# Altium schematic sheet FC_main.SchDoc
size 558 x 431 mm; SheetNumber: 1; SheetTotal: 1
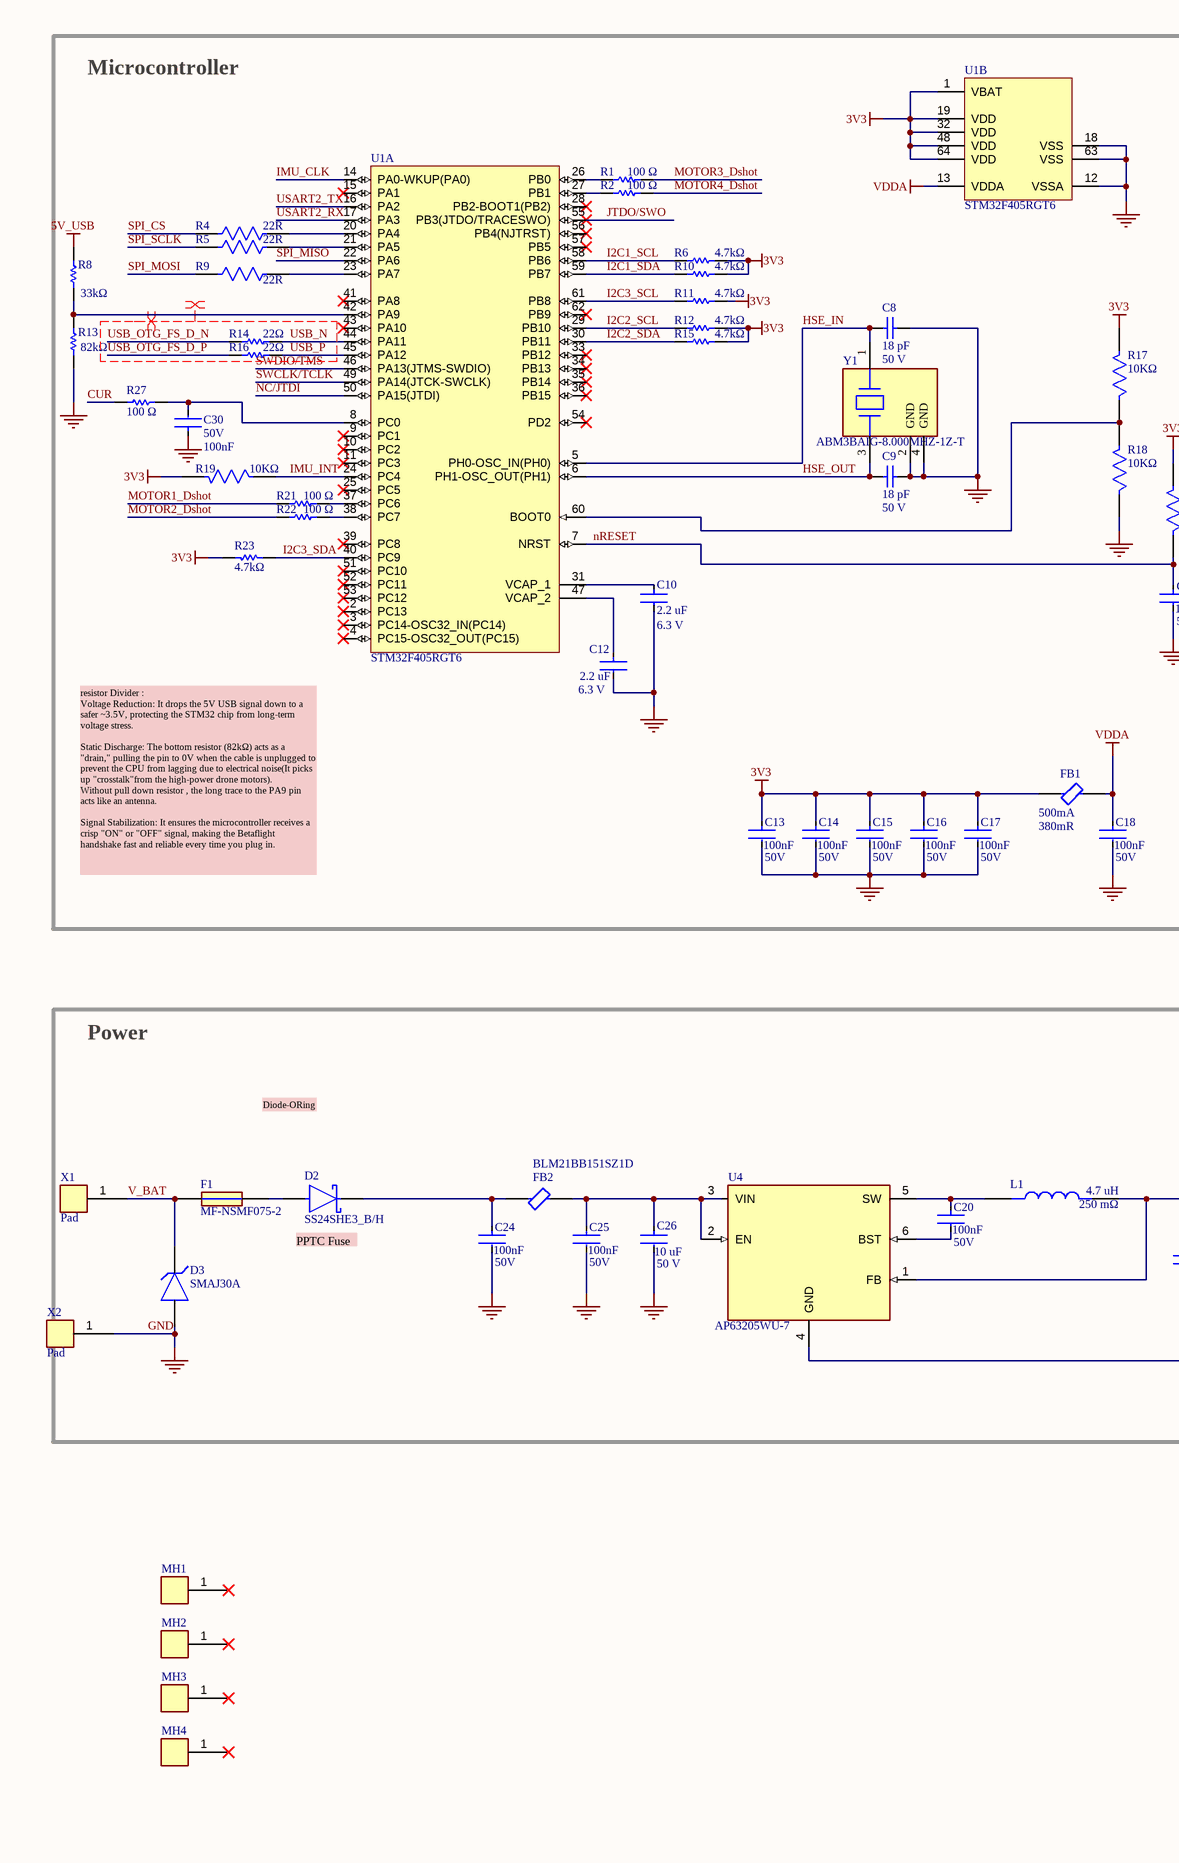
[diagram p0: FC_main.SchDoc, left]
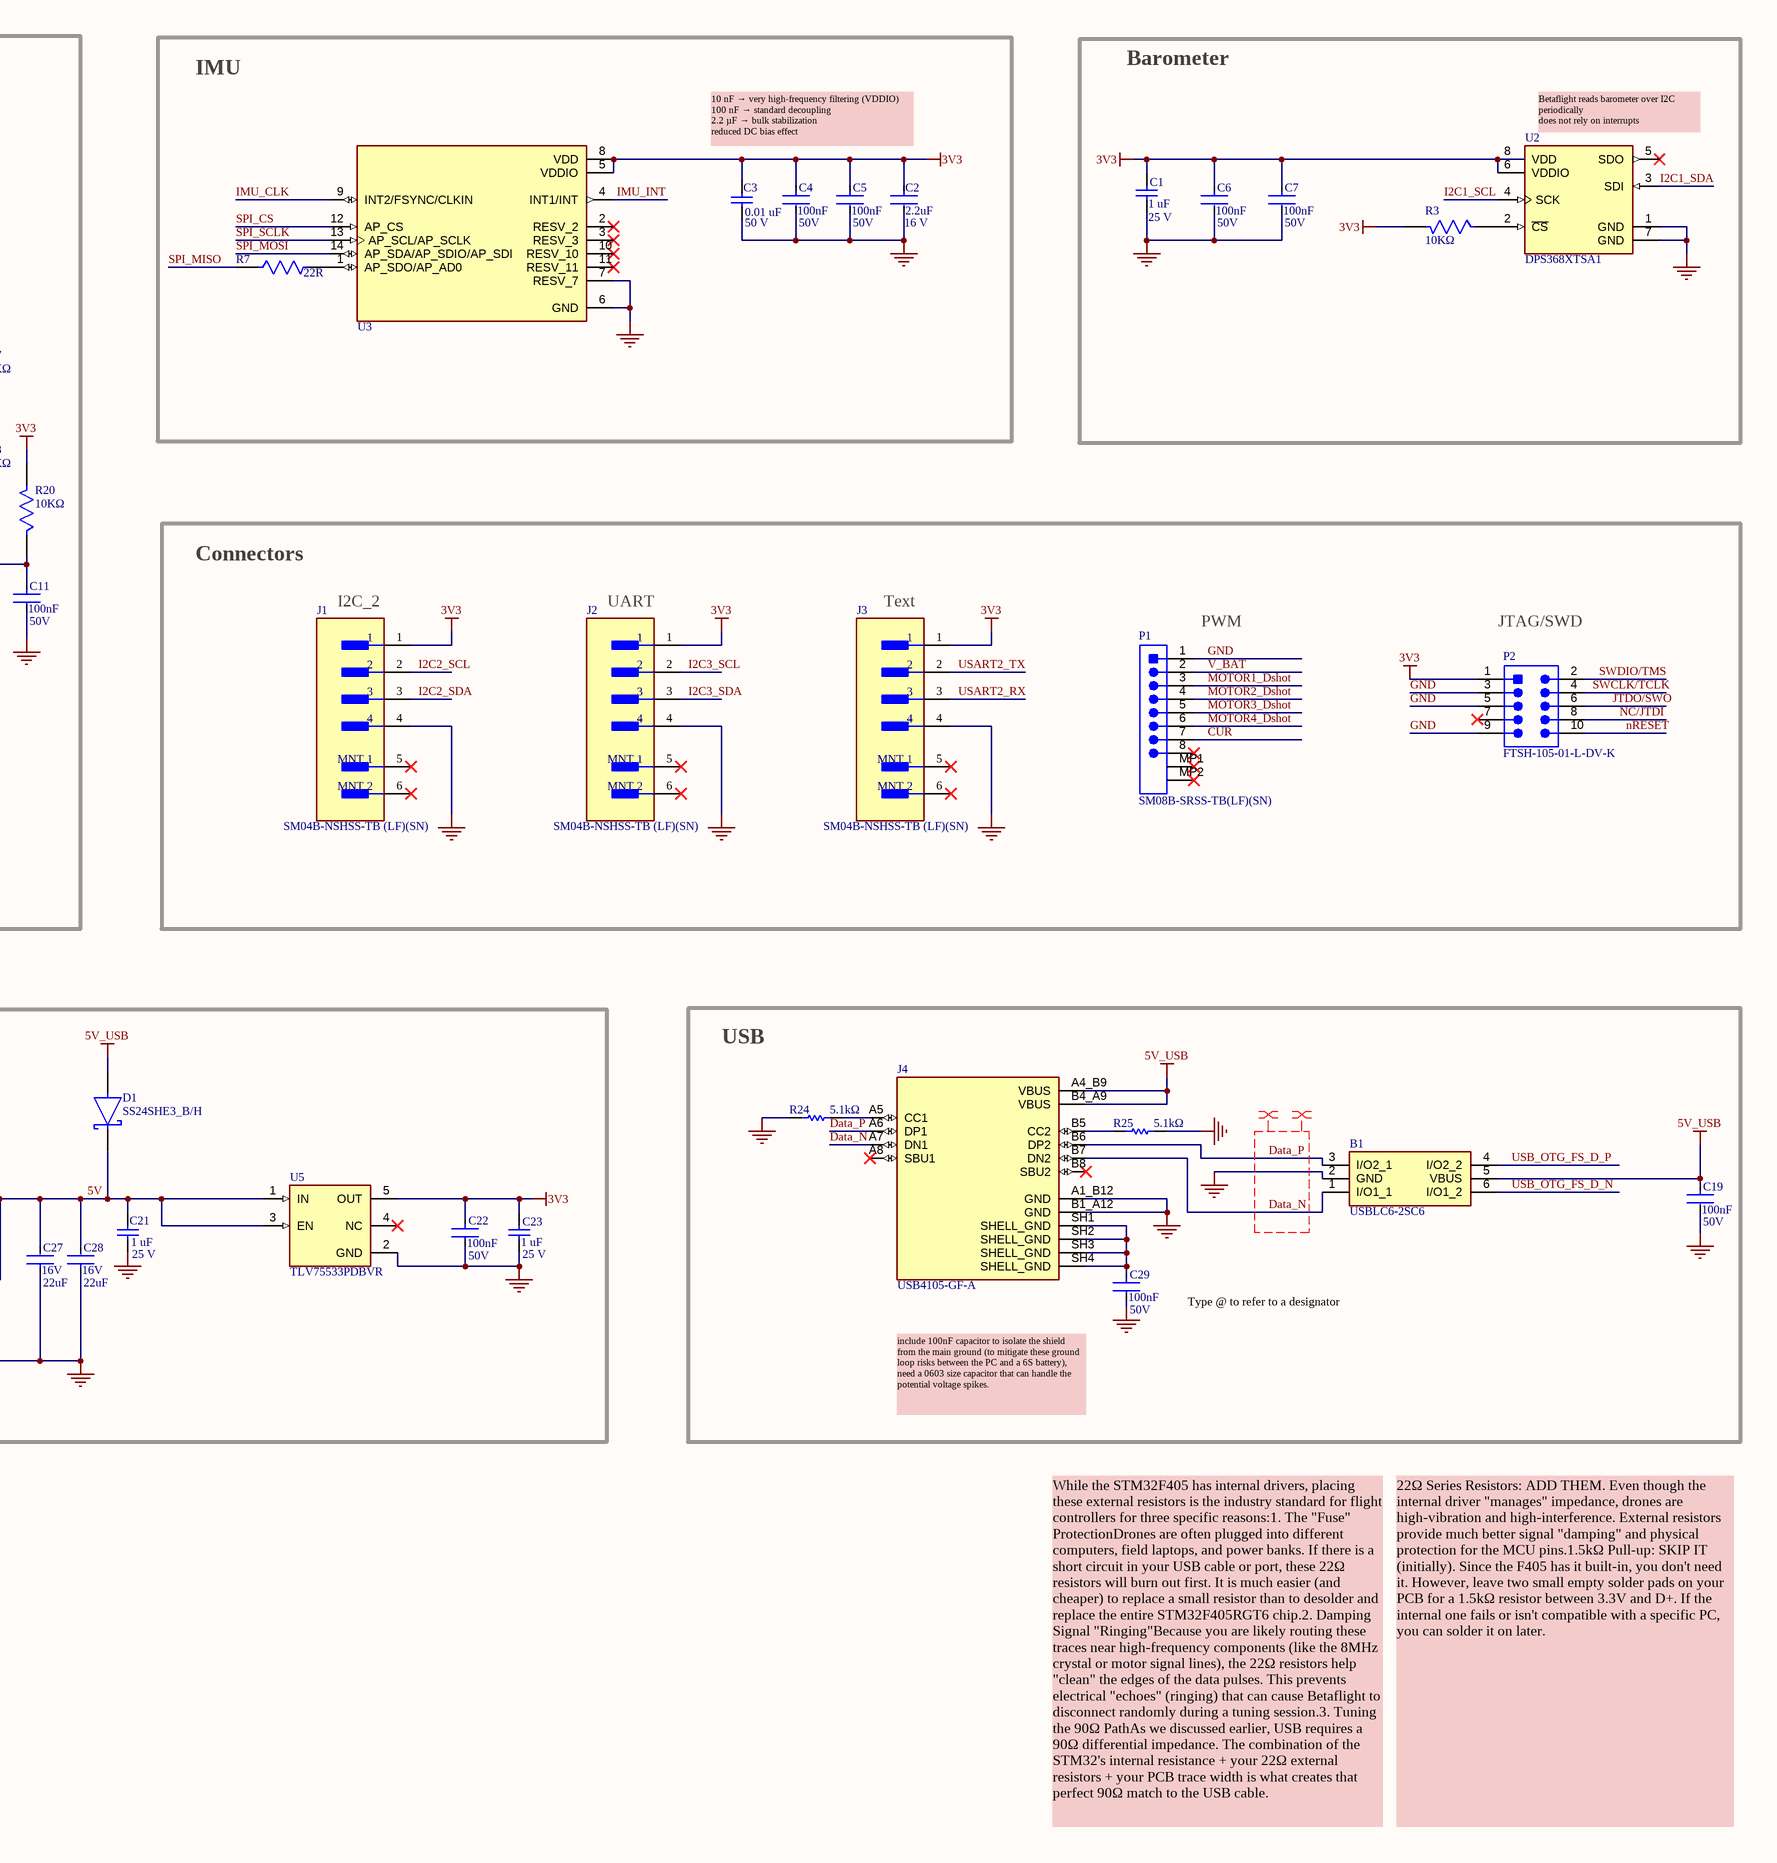
[diagram p1: FC_main.SchDoc, right]

## Parts
B1  USBLC6-2SC6  [SOT95P280X145-6N]
C1  Capacitance: 1 uF  Rated DC voltage: 25 V  [CAPC1608X90X35ML10T15]  (hidden comment: GRM188R71E105KA12D)
C2  Capacitance: 2.2uF  Rated Voltage DC: 16 V  [FP-GRM188-0_2-MFG]  (hidden comment: GRM188Z71C225KE43D)
C3  Capacitance: 0.01 uF  Rated DC voltage: 50 V  [CAPC1608X90X35NL10T15]  (hidden comment: GCM188R71H103KA37J)
C4  Voltage Rating: 50V  Capacitance: 100nF  [FP-CGA3E-0_3-0_1-IPC_A]  (hidden comment: CGA3E2X7R1H104K080AA)
C5  Voltage Rating: 50V  Capacitance: 100nF  [FP-CGA3E-0_3-0_1-IPC_A]  (hidden comment: CGA3E2X7R1H104K080AA)
C6  Voltage Rating: 50V  Capacitance: 100nF  [FP-CGA3E-0_3-0_1-IPC_A]  (hidden comment: CGA3E2X7R1H104K080AA)
C7  Voltage Rating: 50V  Capacitance: 100nF  [FP-CGA3E-0_3-0_1-IPC_A]  (hidden comment: CGA3E2X7R1H104K080AA)
C8  Capacitance: 18 pF  Rated DC voltage: 50 V  [CAPC1005X55X25NL05T10]  (hidden comment: GRM1555C1H180JA01D)
C9  Capacitance: 18 pF  Rated DC voltage: 50 V  [CAPC1005X55X25NL05T10]  (hidden comment: GRM1555C1H180JA01D)
C10  Voltage: 6.3 V  Capacitance: 2.2 uF  [FP-CC0603-DA-MFG]  (hidden comment: CC0603KRX7R5BB225)
C11  Voltage Rating: 50V  Capacitance: 100nF  [FP-CGA3E-0_3-0_1-IPC_A]  (hidden comment: CGA3E2X7R1H104K080AA)
C12  Voltage: 6.3 V  Capacitance: 2.2 uF  [FP-CC0603-DA-MFG]  (hidden comment: CC0603KRX7R5BB225)
C13  Voltage Rating: 50V  Capacitance: 100nF  [FP-CGA3E-0_3-0_1-IPC_A]  (hidden comment: CGA3E2X7R1H104K080AA)
C14  Voltage Rating: 50V  Capacitance: 100nF  [FP-CGA3E-0_3-0_1-IPC_A]  (hidden comment: CGA3E2X7R1H104K080AA)
C15  Voltage Rating: 50V  Capacitance: 100nF  [FP-CGA3E-0_3-0_1-IPC_A]  (hidden comment: CGA3E2X7R1H104K080AA)
C16  Voltage Rating: 50V  Capacitance: 100nF  [FP-CGA3E-0_3-0_1-IPC_A]  (hidden comment: CGA3E2X7R1H104K080AA)
C17  Voltage Rating: 50V  Capacitance: 100nF  [FP-CGA3E-0_3-0_1-IPC_A]  (hidden comment: CGA3E2X7R1H104K080AA)
C18  Voltage Rating: 50V  Capacitance: 100nF  [FP-CGA3E-0_3-0_1-IPC_A]  (hidden comment: CGA3E2X7R1H104K080AA)
C19  Voltage Rating: 50V  Capacitance: 100nF  [FP-CGA3E-0_3-0_1-IPC_A]  (hidden comment: CGA3E2X7R1H104K080AA)
C20  Voltage Rating: 50V  Capacitance: 100nF  [FP-CGA3E-0_3-0_1-IPC_A]  (hidden comment: CGA3E2X7R1H104K080AA)
C21  Capacitance: 1 uF  Rated DC Voltage: 25 V  [CAPC1608X90X35ML10T15]  (hidden comment: GRM188R71E105KA12D)
C22  Voltage Rating: 50V  Capacitance: 100nF  [FP-CGA3E-0_3-0_1-IPC_A]  (hidden comment: CGA3E2X7R1H104K080AA)
C23  Capacitance: 1 uF  Rated DC Voltage: 25 V  [CAPC1608X90X35ML10T15]  (hidden comment: GRM188R71E105KA12D)
C24  Voltage Rating: 50V  Capacitance: 100nF  [FP-CGA3E-0_3-0_1-IPC_A]  (hidden comment: CGA3E2X7R1H104K080AA)
C25  Voltage Rating: 50V  Capacitance: 100nF  [FP-CGA3E-0_3-0_1-IPC_A]  (hidden comment: CGA3E2X7R1H104K080AA)
C26  Capacitance: 10 uF  Rated DC voltage: 50 V  [FP-C3216-160-0_3-MFG]  (hidden comment: C3216X7R1H106K160AC)
C27  Voltage Rating (DC): 16V  Capacitance: 22uF  [FP-C3225-250-0_4-IPC_C]  (hidden comment: C3225X7R1C226K250AC)
C28  Voltage Rating (DC): 16V  Capacitance: 22uF  [FP-C3225-250-0_4-IPC_C]  (hidden comment: C3225X7R1C226K250AC)
C29  Voltage Rating: 50V  Capacitance: 100nF  [FP-CGA3E-0_3-0_1-IPC_A]  (hidden comment: CGA3E2X7R1H104K080AA)
C30  Voltage Rating: 50V  Capacitance: 100nF  [FP-CGA3E-0_3-0_1-IPC_A]  (hidden comment: CGA3E2X7R1H104K080AA)
D1  SS24SHE3_B/H  [FP-95400-MFG]
D2  SS24SHE3_B/H  [FP-95400-MFG]
D3  SMAJ30A  [FP-SMA-MFG]
F1  MF-NSMF075-2  [FUSC3216X70N]
FB1  Max DC Current: 500mA  DC Resistance (DCR): 380mR  [FP-BLM18-0_15-t0_8-MFG]  (hidden comment: BLM18AG601SN1D)
FB2  BLM21BB151SZ1D  [FP-BLM21-0_2-t0_85-e0_5-IPC_B]
J1  SM04B-NSHSS-TB (LF)(SN)  [FP-SM04B-NSHSS-TB_LF_SN-MFG]
J2  SM04B-NSHSS-TB (LF)(SN)  [FP-SM04B-NSHSS-TB_LF_SN-MFG]
J3  SM04B-NSHSS-TB (LF)(SN)  [FP-SM04B-NSHSS-TB_LF_SN-MFG]
J4  USB4105-GF-A  [CONN_USB_C_16P_TOP_SMT_TH]
L1  Maximum DC Resistance: 250 mΩ  Inductance: 4.7 uH  [INDC2520X100N]  (hidden comment: VLS252010HBX-4R7M-1)
MH1  MOUNT_HOLE_M3_GND  [MOUNTING_HOLE_M3]  (value not drawn)
MH2  MOUNT_HOLE_M3_GND  [MOUNTING_HOLE_M3]  (value not drawn)
MH3  MOUNT_HOLE_M3_GND  [MOUNTING_HOLE_M3]  (value not drawn)
MH4  MOUNT_HOLE_M3_GND  [MOUNTING_HOLE_M3]  (value not drawn)
P1  SM08B-SRSS-TB(LF)(SN)  [JST-SM08B-SRSS-TB_V]
P2  FTSH-105-01-L-DV-K  [SMTC-FTSH-105-01-L-DV-K_V]
R1  Resistance: 100 Ω  [RESC1005X40X25ML05T10]  (hidden comment: RC0402FR-07100RL)
R2  Resistance: 100 Ω  [RESC1005X40X25ML05T10]  (hidden comment: RC0402FR-07100RL)
R3  value 10KΩ  [FP-CRGP0603-IPC_C]  (hidden comment: CRGP0603F10K)
R4  Resistance: 22R  [FP-RC0603-0_55-IPC_C]  (hidden comment: RC0603JR-0722RL)
R5  Resistance: 22R  [FP-RC0603-0_55-IPC_C]  (hidden comment: RC0603JR-0722RL)
R6  Resistance: 4.7kΩ  [RESC1005X40X25NL05T10]  (hidden comment: RC0402FR-074K7L)
R7  Resistance: 22R  [FP-RC0603-0_55-IPC_C]  (hidden comment: RC0603JR-0722RL)
R8  Resistance: 33kΩ  [RESC1608X55X25LL10T15]  (hidden comment: RC0603FR-0733KL)
R9  Resistance: 22R  [FP-RC0603-0_55-IPC_C]  (hidden comment: RC0603JR-0722RL)
R10  Resistance: 4.7kΩ  [RESC1005X40X25NL05T10]  (hidden comment: RC0402FR-074K7L)
R11  Resistance: 4.7kΩ  [RESC1005X40X25NL05T10]  (hidden comment: RC0402FR-074K7L)
R12  Resistance: 4.7kΩ  [RESC1005X40X25NL05T10]  (hidden comment: RC0402FR-074K7L)
R13  Resistance: 82kΩ  [RESC1608X55X25LL10T15]  (hidden comment: RC0603FR-0782KL)
R14  Resistance: 22Ω  [RESC1608X55X25NL10T15]  (hidden comment: RC0603FR-0722RL)
R15  Resistance: 4.7kΩ  [RESC1005X40X25NL05T10]  (hidden comment: RC0402FR-074K7L)
R16  Resistance: 22Ω  [RESC1608X55X25NL10T15]  (hidden comment: RC0603FR-0722RL)
R17  value 10KΩ  [FP-CRGP0603-IPC_C]  (hidden comment: CRGP0603F10K)
R18  value 10KΩ  [FP-CRGP0603-IPC_C]  (hidden comment: CRGP0603F10K)
R19  value 10KΩ  [FP-CRGP0603-IPC_C]  (hidden comment: CRGP0603F10K)
R20  value 10KΩ  [FP-CRGP0603-IPC_C]  (hidden comment: CRGP0603F10K)
R21  Resistance: 100 Ω  [RESC1005X40X25ML05T10]  (hidden comment: RC0402FR-07100RL)
R22  Resistance: 100 Ω  [RESC1005X40X25ML05T10]  (hidden comment: RC0402FR-07100RL)
R23  Resistance: 4.7kΩ  [RESC1005X40X25NL05T10]  (hidden comment: RC0402FR-074K7L)
R24  Resistance: 5.1kΩ  [RESC1608X55X25ML10T15]  (hidden comment: RC0603FR-075K1L)
R25  Resistance: 5.1kΩ  [RESC1608X55X25ML10T15]  (hidden comment: RC0603FR-075K1L)
R27  Resistance: 100 Ω  [RESC1005X40X25ML05T10]  (hidden comment: RC0402FR-07100RL)
U1  STM32F405RGT6  [STM-LQFP64_M]  (parts A,B of 2)
U2  DPS368XTSA1  [LGA200P250X200X110-8N]
U3  ICM-42688-P  [PQFN50P300X250X97-14N]  (value not drawn)
U4  AP63205WU-7  [SOT95P280X145-6N]
U5  TLV75533PDBVR  [FP-DBV0005A-MFG]
X1  Pad  [Solder_Wire_Pad]
X2  Pad  [Solder_Wire_Pad]
Y1  ABM3BAIG-8.000MHZ-1Z-T  [FP-ABM3BAIG-MFG]

## Blocks framed on the sheet
Microcontroller: C8-C18 C30 FB1 R1 R2 R4-R6 R8-R23 R27 U1 Y1
IMU: C2-C5 R7 U3
Barometer: C1 C6 C7 R3 U2
Connectors: J1-J3 P1 P2
Power: C20-C28 D1-D3 F1 FB2 L1 U4 U5 X1 X2
USB: B1 C19 C29 J4 R24 R25

## Nets
3V3: C1.2 C2.1 C3.2 C4.1 C5.1 C6.1 C7.1 C13.1 C14.1 C15.1 C16.1 C17.1 C22.1 C23.2 FB1.1 J1.1 J2.1 J3.1 P2.1 R3.2 R6.2 R10.2 R11.2 R12.2 R15.2 R17.2 R19.2 R20.2 R23.2 U1.1(VBAT) U1.19(VDD) U1.32(VDD) U1.48(VDD) U1.64(VDD) U2.6(VDDIO) U2.8(VDD) U3.5(VDDIO) U3.8(VDD) U5.5(OUT)
5V_USB: B1.5(VBUS) C19.1 D1.2(A) J4.A4_B9(VBUS) J4.B4_A9(VBUS) R8.2
GND: B1.2(GND) C1.1 C2.2 C3.1 C4.2 C5.2 C6.2 C7.2 C8.1 C9.1 C10.2 C11.2 C12.2 C13.2 C14.2 C15.2 C16.2 C17.2 C18.2 C19.2 C21.1 C22.2 C23.1 C24.2 C25.2 C26.2 C27.1 C28.1 C29.2 C30.1 D3.2(A) J1.4 J2.4 J3.4 J4.A1_B12(GND) J4.B1_A12(GND) P1.1 P2.3 P2.5 P2.9 R13.1 R18.1 R24.1 R25.2 U1.12(VSSA) U1.18(VSS) U1.63(VSS) U2.1(GND) U2.7(GND) U3.6(GND) U3.7(RESV_7) U4.4(GND) U5.2(GND) X2.1 Y1.2(GND) Y1.4(GND)
VDDA: C18.1 FB1.2 U1.13(VDDA)
5V: C21.2 C27.2 C28.2 D1.1(C) L1.2 U4.1(FB) U5.1(IN) U5.3(EN)
CUR: P1.7 R27.1
Data_N: B1.1(I/O1_1) J4.A7(DN1) J4.B7(DN2)
Data_P: B1.3(I/O2_1) J4.A6(DP1) J4.B6(DP2)
HSE_IN: C8.2 U1.5(PH0-OSC_IN(PH0)) Y1.1
HSE_OUT: C9.2 U1.6(PH1-OSC_OUT(PH1)) Y1.3
I2C1_SCL: R6.1 U1.58(PB6) U2.4(SCK)
I2C1_SDA: R10.1 U1.59(PB7) U2.3(SDI)
I2C2_SCL: J1.2 R12.1 U1.29(PB10)
I2C2_SDA: J1.3 R15.1 U1.30(PB11)
I2C3_SCL: J2.2 R11.1 U1.61(PB8)
I2C3_SDA: J2.3 R23.1 U1.40(PC9)
IMU_CLK: U1.14(PA0-WKUP(PA0)) U3.9(INT2/FSYNC/CLKIN)
IMU_INT: R19.1 U1.24(PC4) U3.4(INT1/INT)
JTDO/SWO: P2.6 U1.55(PB3(JTDO/TRACESWO))
MOTOR1_Dshot: P1.3 R21.2
MOTOR2_Dshot: P1.4 R22.2
MOTOR3_Dshot: P1.5 R1.1
MOTOR4_Dshot: P1.6 R2.1
NC/JTDI: P2.8 U1.50(PA15(JTDI))
nRESET: C11.1 P2.10 R20.1 U1.7(NRST)
SPI_CS: R4.1 U3.12(AP_CS)
SPI_MISO: R7.1 U1.22(PA6)
SPI_MOSI: R9.1 U3.14(AP_SDA/AP_SDIO/AP_SDI)
SPI_SCLK: R5.1 U3.13(AP_SCL/AP_SCLK)
SWCLK/TCLK: P2.4 U1.49(PA14(JTCK-SWCLK))
SWDIO/TMS: P2.2 U1.46(PA13(JTMS-SWDIO))
USART2_RX: J3.3 U1.17(PA3)
USART2_TX: J3.2 U1.16(PA2)
USB_N: R14.1 U1.44(PA11)
USB_OTG_FS_D_N: B1.6(I/O1_2) R14.2
USB_OTG_FS_D_P: B1.4(I/O2_2) R16.2
USB_P: R16.1 U1.45(PA12)
V_BAT: D3.1(C) F1.1 P1.2 X1.1
NetC10_1: C10.1 U1.31(VCAP_1)
NetC12_1: C12.1 U1.47(VCAP_2)
NetC20_1: C20.1 L1.1 U4.5(SW)
NetC20_2: C20.2 U4.6(BST)
NetC24_1: C24.1 D2.1(C) FB2.1
NetC25_1: C25.1 C26.1 FB2.2 U4.2(EN) U4.3(VIN)
NetC29_1: C29.1 J4.SH1(SHELL_GND) J4.SH2(SHELL_GND) J4.SH3(SHELL_GND) J4.SH4(SHELL_GND)
NetC30_2: C30.2 R27.2 U1.8(PC0)
NetD2_2: D2.2(A) F1.2
NetJ4_A5: J4.A5(CC1) R24.2
NetJ4_B5: J4.B5(CC2) R25.1
NetR1_2: R1.2 U1.26(PB0)
NetR2_2: R2.2 U1.27(PB1)
NetR3_1: R3.1 U2.2(~{CS})
NetR4_2: R4.2 U1.20(PA4)
NetR5_2: R5.2 U1.21(PA5)
NetR7_2: R7.2 U3.1(AP_SDO/AP_AD0)
NetR8_1: R8.1 R13.2 U1.42(PA9)
NetR9_2: R9.2 U1.23(PA7)
NetR17_1: R17.1 R18.2 U1.60(BOOT0)
NetR21_1: R21.1 U1.37(PC6)
NetR22_1: R22.1 U1.38(PC7)

Not connected (* = marked no-connect by the designer): J1 5(MNT_1)* 6(MNT_2)*; J2 5(MNT_1)* 6(MNT_2)*; J3 5(MNT_1)* 6(MNT_2)*; J4 A8(SBU1)* B8(SBU2)*; MH1 1*; MH2 1*; MH3 1*; MH4 1*; P1 8* MP1* MP2*; P2 7*; U1 2(PC13)* 3(PC14-OSC32_IN(PC14))* 4(PC15-OSC32_OUT(PC15))* 9(PC1)* 10(PC2)* 11(PC3)* 15(PA1)* 25(PC5)* 28(PB2-BOOT1(PB2))* 33(PB12)* 34(PB13)* 35(PB14)* 36(PB15)* 39(PC8)* 41(PA8)* 43(PA10)* 51(PC10)* 52(PC11)* 53(PC12)* 54(PD2)* 56(PB4(NJTRST))* 57(PB5)* 62(PB9)*; U2 5(SDO)*; U3 2(RESV_2)* 3(RESV_3)* 10(RESV_10)* 11(RESV_11)*; U5 4(NC)*

## Layout directives
differential pair: Data_N, Data_P, USB_N, USB_OTG_FS_D_N, USB_OTG_FS_D_P, USB_P
net class USB; rule Differential Pairs Routing [Pref Gap = 5mil    Min Gap  = 5mil    Max Gap  = 5milPref Width = 4.347mil    Min Width  = 4.347mil    Max Width  = 4.347mil]: Data_N, Data_P, USB_N, USB_OTG_FS_D_N, USB_OTG_FS_D_P, USB_P

## Notes on the sheet
- 10 nF → very high-frequency filtering (VDDIO)
  100 nF → standard decoupling
  2.2 µF → bulk stabilization
  reduced DC bias effect
- (near U2) Betaflight reads barometer over I2C periodically
  does not rely on interrupts
- (near J1) I2C_2
- (near J2) UART
- (near J3) Text
- (near P1) PWM
- (near P2) JTAG/SWD
- resistor Divider :
  Voltage Reduction: It drops the 5V USB signal down to a safer ~3.5V, protecting the STM32 chip from long-term voltage stress.
  Static Discharge: The bottom resistor (82kΩ) acts as a "drain," pulling the pin to 0V when the cable is unplugged to prevent the CPU from lagging due to electrical noise(It picks up "crosstalk"from the high-power drone motors).
  Without pull down resistor , the long trace to the PA9 pin acts like an antenna.
  Signal Stabilization: It ensures the microcontroller receives a crisp "ON" or "OFF" signal, making the Betaflight handshake fast and reliable every time you plug in.
- Diode-ORing
- (near D2) PPTC Fuse
- Type @ to refer to a designator
- include 100nF capacitor to isolate the shield from the main ground (to mitigate these ground loop risks between the PC and a 6S battery), need a 0603 size capacitor that can handle the potential voltage spikes.
- While the STM32F405 has internal drivers, placing these external resistors is the industry standard for flight controllers for three specific reasons:1. The "Fuse" ProtectionDrones are often plugged into different computers, field laptops, and power banks. If there is a short circuit in your USB cable or port, these 22Ω resistors will burn out first. It is much easier (and cheaper) to replace a small resistor than to desolder and replace the entire STM32F405RGT6 chip.2. Damping Signal "Ringing"Because you are likely routing these traces near high-frequency components (like the 8MHz crystal or motor signal lines), the 22Ω resistors help "clean" the edges of the data pulses. This prevents electrical "echoes" (ringing) that can cause Betaflight to disconnect randomly during a tuning session.3. Tuning the 90Ω PathAs we discussed earlier, USB requires a 90Ω differential impedance. The combination of the STM32's internal resistance + your 22Ω external resistors + your PCB trace width is what creates that perfect 90Ω match to the USB cable.
- 22Ω Series Resistors: ADD THEM. Even though the internal driver "manages" impedance, drones are high-vibration and high-interference. External resistors provide much better signal "damping" and physical protection for the MCU pins.1.5kΩ Pull-up: SKIP IT (initially). Since the F405 has it built-in, you don't need it. However, leave two small empty solder pads on your PCB for a 1.5kΩ resistor between 3.3V and D+. If the internal one fails or isn't compatible with a specific PC, you can solder it on later.
- DWG. NO.
- REV.
- SHT.
- REVISION
- DESCRIPTION
- DATE
- APPROVED
- THIS DOCUMENT AND THE DATA DISCLOSED HEREIN OR HEREWITH IS THE PROPERTY OF ALTIUM LIMITED AND MAY BE FREELY DISTRIBUTED IN WHOLE. NO RIGHTS ARE RESERVED OR EXPRESS OR IMPLIED WARANTEE GIVEN.
- ENG:
- DSN:
- APPROVALS
- PROJECT
- DOCUMENT REVISION:
- DESIGN ITEM:
- CHK:
- BOM:
- REFERENCE DOCUMENTS
- PROJECT REVISION:
- TITLE
- FAB DWG:
- PCB DWG:
- ASSY DWG:
- SCALE:
- SIZE
- C
- CAGE CODE
- FILE NAME
- DWG NO.
- SHEET
- OF
- REV

## Library data of the parts
B1 = USBLC6-2SC6: TVS Diode Array Uni-Directional USBLC6-2SC6 17V, SOT-23 6-Pin; Manufacturer_Name: STMicroelectronics; Geometry.Height: 1.45mm; Mouser Part Number: 511-USBLC6-2SC6; Mouser Price/Stock: https://www.mouser.co.uk/ProductDetail/STMicroelectronics/USBLC6-2SC6?qs=po45yt2pPpu%2FhNIlwQdTlg%3D%3D; Manufacturer_Part_Number: USBLC6-2SC6; Datasheet Link: https://www.st.com/resource/en/datasheet/usblc6-2.pdf
C1 C21 C23 = CMP-2006-02460-1: Manufacturer: Murata; Part Number: GRM188R71E105KA12D
C2 = CMP-06035-057307-1: Chip Multilayer Ceramic Capacitors for General Purpose, 0603, 2.2uF, X7R, 15%, 10%, 16V; Case/Package: 0603
C3 = CMP-2006-02374-1: Manufacturer: Murata; Part Number: GCM188R71H103KA37J
C4-C7 C11 C13-C20 C22 C24 C25 C29 C30 = CMP-2000-07546-2: Cap Ceramic 100nF 50V X7R 10% Pad SMD 0603 +125°C Automotive T/R; Weight: 7.1E-05oz; Composition: Ceramic; Max Operating Temperature: 125°C; Termination: SMD/SMT; Dielectric: X7R; Length: 1.6mm; Package Quantity: 1; REACH SVHC: No SVHC; Lead Free: Lead Free; Case Code (Metric): 1608; Min Operating Temperature: -55°C; Packaging: Tape and Reel; Tolerance: 10%; Case Code (Imperial): 0603; Case/Package: 0603; Voltage Rating (DC): 50V; Depth: 0.8mm; Radiation Hardening: No; Ratings: AEC-Q200; Mount: Surface Mount; Voltage: 50V; Thickness: 0.035inch; Width: 0.8mm; Height: 0.8mm
C8 C9 = CMP-2008-03918-1: Manufacturer: Murata; Part Number: GRM1555C1H180JA01D
C10 C12 = CMP-03422-000579-1: 0603 2.2 uF 6.3 V 10% Tolerance X7R Multilayer Ceramic Capacitor; Manufacturer: YAGEO; Value: 2.2 uF; Temperature Coefficient: 15%; Tolerance: 0.1; Mouser Description: Multilayer Ceramic Capacitors MLCC - SMD/SMT 2.2uF 6.3V X7R 10%; Lead Free: Yes; Temperature Range Low: -55°C; Voltage Rating: 6.3 V; ComponentLink2Description: Datasheet; Package: CC0603-DA; Temperature Range High: +125°C; Octopart: https://octopart.com/cc0603krx7r5bb225-yageo-25629540; Category: Cap; Height: 0.9mm; Temperature Characteristic: X7R; RoHS: TRUE; Device Class L3: Ceramic Capacitors; Material: Ceramic; Automotive: No; Device Class L1: Passive Components; Digikey Description: 0603 2.2 uF 6.3 V 10% Tolerance X7R Multilayer Ceramic Capacitor; Temperature: -55°C to +125°C; ComponentLink2URL: http://www.yageo.com/documents/recent/UPY-GPHC_X7R_6.3V-to-50V_18.pdf; Footprint Url: http://www.yageo.com/exep/pages/download/literatures/UPY-C_GEN_24.pdf; Manufacturer Part Number: CC0603KRX7R5BB225; Device Class L2: Capacitors
C26 = CMP-08246-004811-1: Multilayer Ceramic Capacitors 10uF ±10% 50V X7R SMD 1206; RoHS Compliant: Yes
C27 C28 = CMP-2000-07543-2: Multilayer Ceramic Capacitors 22uF ±10% 16V X7R SMD 1210; RoHS Compliant: Yes; Thickness: 0.11inch; Packaging: Tape and Reel; Voltage: 16V; Length: 3.2mm; Radiation Hardening: No; Case/Package: 1210; Tolerance: 10%; Package Quantity: 1; Series: C; Lead Free: Lead Free; Voltage Rating: 16V; Number of Pins: 2; Weight: 0.000564oz; Height: 2.5mm; Case Code (Metric): 3225; Depth: 2.5mm; Min Operating Temperature: -55°C; Termination: SMD/SMT; Dielectric Material: Ceramic; Mount: Surface Mount; Resistor Type: Ceramic; Max Operating Temperature: 125°C; Construction: Flat; Dielectric: X7R; Width: 0.098inch; REACH SVHC: No SVHC; Case Code (Imperial): 1210
D1 D2 = CMP-02539-000047-1: DIODE SCHOTTKY 2A 40V DO-214AC; RoHS Compliant: Yes
D3 = CMP-07401-000015-1: TVS DIODE 30V 48.4V SMA; Manufacturer: Bourns Inc.; Max Junction Temp: +150°C; Peak Pulse Power: 400W; Breakdown Voltage: 33.3V; Number Of Channels: 1; Peak Pulse Current: 8.3A; Direction: Unidirectional; Temperature: -55°C to +150°C; Octopart: https://octopart.com/smaj30a-bourns-12809375; Automotive: No; Clamping Voltage: 48.4V; ComponentLink2Description: Datasheet; Mouser Description: TVS Diodes / ESD Suppressors 30volts 5uA 8.3 Amps Uni-Dir; Lead Free: Yes; Category: Diode; Manufacturer Part Number: SMAJ30A; Reverse Standoff Voltage: 30V; Digikey Description: TVS DIODE 30V 48.4V SMA; RoHS: TRUE; Device Class L2: TVS Diodes; Device Class L1: Circuit Protection; Device Class L3: unset; ComponentLink2URL: https://www.bourns.com/docs/Product-Datasheets/SMAJ.pdf; Height: 2.29mm; Temperature Range Low: -55°C; Package: SMA; Temperature Range High: +150°C
F1 = MF-NSMF075-2: Fuse, PTC, Resettable, SMD, 1206, 750mA Bourns 0.75A Surface Mount Resettable Fuse, 6 V; Geometry.Height: 0.7mm; Mouser Part Number: 652-MF-NSMF075-2; Mouser Price/Stock: https://www.mouser.co.uk/ProductDetail/Bourns/MF-NSMF075-2?qs=mNcyDCkSNSLb3OOWqHSxUA%3D%3D; Manufacturer_Name: Bourns; Manufacturer_Part_Number: MF-NSMF075-2; Datasheet Link: https://componentsearchengine.com/Datasheets/2/MF-NSMF075-2.pdf
FB1 = CMP-0686-00436-3: Chip Ferrite Bead, 0603, 600Ω @ 100MHz, 0.38Ω, 25%, 500mA; Number of Lines: 1; Impedance: 600R; Material: Steel; Shielding: Unshielded; Termination: SMD/SMT; Military Standard: Not; Number of Circuits: 1; Min Operating Temperature: -55°C; Case Code (Imperial): 0603; Width: 0.8mm; Current Rating: 500mA; Lead Free: Lead Free; Packaging: Tape and Reel; Frequency: 100MHz; Max Operating Temperature: 125°C; DC Current: 500mA; REACH SVHC: No SVHC; Case/Package: 0603; Package Quantity: 1; Height: 0.8mm; Number of Pins: 2; Depth: 0.8mm; Test Frequency: 100MHz; Case Code (Metric): 1608; Tolerance: 25%; Core Material: Ferrite; Weight: 7.1E-05oz; Max Current Rating: 500mA; Radiation Hardening: No; Length: 1.6mm; RoHS Compliant: Yes
FB2 = CMP-06046-002585-1: Chip Ferrite Bead, 0805, 150Ω @ 100MHz, 0.21Ω, 25%, 600mA
J1-J3 = CMP-17439-000227-1: CONN HEADER SMD R/A 4POS 1MM; Pitch: 0.039inch; Number of Positions: 4; Voltage Rating: 50V; Insulation Color: Natural; Contact Finish - Mating: TIN; Number of Rows: 1; Packaging: Cut Tape; Max Operating Temperature: 85°C; Contact Type: Male Pin; Contact Plating: Tin; Termination: Solder; Fastening Type: Latch; Contact Material: Copper Alloy; Flammability Rating: UL94 V-0; Series: NSH; Insulation Material: Nylon; Connector Type: Header; Color: Natural; Mount: Surface Mount; Min Operating Temperature: -25°C
L1 = VLS252010HBX-4R7M-1: 4.7uH ±20% Shielded Power Inductor, 1.09A, 2520 (1008 Metric)
P1 = CMP-2000-07082-1: Male Header, Pitch 1 mm, 1 x 8 Position, Height 2.95 mm, -25 to 85 degC, RoHS, Tape and Reel; Manufacturer: JST; Style/Orientation: RightAngleHeader/Plug; Pitch: 1mm; No of Positions: 8; Manufacturer URL: http://www.jst.com/home2.html; Mounting Technology: SurfaceMount; Package Description: Male Header, Pitch 1 mm, 1 x 8 Position, Height 2.95 mm; Datasheet URL: http://www.jst-mfg.com/product/pdf/eng/eSR.pdf; Type: ShroudedHeader; Termination: Crimp; Package Reference: SM08B-SRSS-TB; Datasheet Version: 11/2010
P2 = CMP-2000-05353-1: Male Header, Pitch 1.27 mm, 2 x 5 Position, Height 6.25 mm; Manufacturer: Samtec; Pitch: 0.050"(1.27mm); Other Names: Q3937619; Number of Positions: 10; Mating Products: SFMC-105-L2-S-D-TR-ND / -CONN.05"SURFACE10POSSMT / FLE-105-01-G-DV-TR-ND / -CONNSKT1.27MM10POSDUALSMD / FLE-105-01-G-DV-A-P-ND / -CONNSKT1.27MM10POSDUALSMD / FLE-105-01-G-DV-A-ND / -CONNSKT1.27MM10POSDUALSMD / CLP-105-02-G-D-P-TR-ND / -CONNRCPT10POSDUAL.05"SMD / SAM1155-05-ND / -CONNRCPT10POSDUAL.05"SMD / SAM1154-05-ND / -CONNRCPT10POSDUAL.05"SMD / SAM1153-05-ND / -CONNRCPT10POSDUAL.05"SMD / SAM1226-05-ND / -CONNRCPT.05"10POSDUALSMD; Number of Positions Loaded: All; Connector Type: Header,Unshrouded; Product Training Modules: Board-to-BoardConnectors; Datasheet Version: Rev. ET, 10/1995; Number of Rows: 2; Standard Package: 1; Package Description: Male Header, Pitch 1.27 mm, 2 x 5 Position, Height 5.97 mm, Tail Length 4.32 mm; Contact Finish Thickness: 10µin(0.25µm); Series: FTSH; Termination: Solder; Contact Type: MalePin; Color: Black; Package Reference: FTSH-105-01-L-DV-K; Family: RectangularConnectors-Headers,MalePins; Package URL: http://suddendocs.samtec.com/prints/ftsh-1xx-xx-xxx-dv-xxx-footprint.pdf; Packaging: Tube; Mounting Type: SurfaceMount; Category: Connectors,Interconnects; Datasheet URL: http://suddendocs.samtec.com/prints/ftsh-1xx-xx-xxx-dv-xxx-mkt.pdf; Row Spacing: 0.050"(1.27mm); Manufacturer URL: http://www.samtec.com/; Contact Mating Length: 0.120"(3.05mm); Contact Finish: Gold
R1 R2 R21 R22 R27 = CMP-2002-07344-1: Manufacturer: Yageo / Phycomp; Part Number: RC0402FR-07100RL; Parameter 2: *
R3 R17-R20 = CMP-03211-004414-1: CRGP 0603 10K 1%; Manufacturer: TE; Voltage Rating: 50V; Power Rating: 0.25W; Tolerance: 0.01; Temperature Coefficient: ±100ppm/°C; Octopart: https://octopart.com/crgp0603f10k-te+connectivity-91018721; Temperature Range Low: -55°C; Temperature Range High: +155°C; Device Class L3: Chip SMD Resistors; Package: CRGP0603; Height: 0.55mm; Series: CRGP; RoHS: TRUE; Composition: Thick Film; Digikey Description: CRGP 0603 10K 1%; Ipc Land Pattern Name: RESC16080X45; Mouser Description: Res, 10K, 1%, 0.25W, 0603, Thick Film; ComponentLink2Description: Datasheet; ComponentLink2URL: https://www.te.com/commerce/DocumentDelivery/DDEController?Action=srchrtrv&DocNm=9-1773463-9&DocType=DS&DocLang=English; Manufacturer Part Number: CRGP0603F10K; Temperature: -55°C to +155°C; Device Class L1: Passive Components; Lead Free: Yes; Ambient Temperature Range High: +70°C; Device Class L2: Resistors; Automotive: No; Category: Res; Resistance: 10KΩ
R4 R5 R7 R9 = CMP-03412-037819-1: RES SMD 22 OHM 5% 1/10W 0603; Temperature Coefficient: 100ppm/°C; Max Power Dissipation: 100mW; Voltage Rating: 50V; Length: 1.6mm; Tolerance: 5%; Resistance Tolerance: 5%; Number of Terminations: 2; Construction: Rectangular; Min Operating Temperature: -55°C; Lead Free: Lead Free; Width: 0.8mm; Case Code (Imperial): 0603; Voltage Rating (DC): 50V; Case/Package: 0603; Features: Moisture Resistant; REACH SVHC: No SVHC; Military Standard: Not; RoHS Compliant: Yes; Max Operating Temperature: 155°C; Number of Pins: 2; Termination: SMD/SMT; Case Code (Metric): 1608; Packaging: Tape and Reel; Resistor Type: Thick Film; Depth: 0.8mm; Size Code: 0603; Power Rating: 100mW; Series: RC
R6 R10-R12 R15 R23 = CMP-1011-00586-2: Manufacturer: Yageo / Phycomp; Part Number: RC0402FR-074K7L; Parameter 2: *
R8 = CMP-2000-06938-1: Chip Resistor, 33 KOhm, +/- 1%, 0.1 W, -55 to 155 degC, 0603 (1608 Metric), RoHS, Tape and Reel; Manufacturer: Yageo; Voltage Rating: 50V; Power Rating: 100mW; Temperature Coefficient: 100PPM/C; Datasheet Version: Rev. 7, 05/2017; Case Code - in: 0603; Product: ThickFilmResistorsGeneralPurpose; Tolerance: 1%; Case Code - mm: 1608; Manufacturer URL: http://www.yageo.com/; Datasheet URL: http://www.yageo.com/documents/recent/PYu-RC_Group_51_RoHS_L_7.pdf; Termination Style: SMD/SMT; Package Description: 2-Pin Surface Mount Device, Body 1.6 x 0.8 mm; Series: RC; Packaging: Reel; Mounting Technology: SurfaceMount; Operating Temperature Range: -55Cto+155C; Package Reference: 0603
R13 = CMP-2000-06947-1: Chip Resistor, 82 KOhm, +/- 1%, 0.1 W, -55 to 155 degC, 0603 (1608 Metric), RoHS, Tape and Reel; Manufacturer: Yageo; Temperature Coefficient: 100PPM/C; Unit Weight: 0.000071oz; Voltage Rating: 75V; Power Rating: 100mW; Packaging: Reel; Package Description: 2-Pin Surface Mount Device, Body 1.6 x 0.8 mm; Package / Case: 0603(1608metric); Series: RC; Operating Temperature Range: -55Cto+155C; Brand: Yageo; Case Code - in: 0603; Width: 0.8mm; Height: 0.45mm; Product Category: ThickFilmResistors; Length: 1.6mm; Product: ThickFilmResistorsGeneralPurpose; Manufacturer URL: http://www.yageo.com/; Datasheet URL: http://www.yageo.com/documents/recent/PYu-RC_Group_51_RoHS_L_7.pdf; RoHS: True; Datasheet Version: Rev. 7, 05/2017; Tolerance: 1%; Case Code - mm: 1608; Package Reference: 0603; Mounting Technology: SurfaceMount; Type: GeneralPurposeChipResistorSurfaceMount; Termination Style: SMD/SMT
R14 R16 = CMP-1659-00033-1: Chip Resistor, 22 Ohm, +/- 1%, 0.1 W, -55 to 155 degC, 0603 (1608 Metric), RoHS, Tape and Reel; ComponentLink2URL: http://www.yageo.com/documents/recent/PYu-RC_Group_51_RoHS_L_04.pdf; ComponentLink1Description: Manufacturer URL; ComponentLink1URL: http://www.yageo.com/; PackageReference: 0603; ComponentLink2Description: Datasheet
R24 R25 = CMP-2000-04091-1: Manufacturer: Yageo; Part Number: RC0603FR-075K1L
U1 = CMP-0243-00019-3: ARM Cortex-M4 32-bit MCU+FPU, 210 DMIPS, 1024 kB Flash, 192 kB Internal RAM, 51 I/Os, 64-pin LQFP, -40 to 85 degC, Tray; Manufacturer: STMicroelectronics; Supply Voltage(Vcc) min (V): 1.8; Supply Voltage(Vcc) max (V): 3.6; Internal RAM Size (kB): 192; I/Os (High Current): 51; D/A Converter: 2x12-bit; FLASH Size (Prog) (kB): 1024; Operating Frequency(F) (Processor speed) (MHz): 168; ComponentLink2Description: Datasheet; PackageVersion: Rev. 4, 06/2013; DatasheetVersion: Rev. 4; Core: ARM Cortex-M4; ComponentLink2URL: http://www.st.com/st-web-ui/static/active/en/resource/technical/document/datasheet/DM00037051.pdf; PackageReference: LQFP64; Packing: Tray; ComponentLink1Description: Manufacturer URL; ComponentLink3URL: http://www.st.com/st-web-ui/static/active/en/resource/technical/document/datasheet/DM00037051.pdf; ComponentLink3Description: Package Specification; Mounting Technology: Surface Mount; ComponentLink1URL: http://www.st.com/web/en/home.html; PackageDescription: 64-Pin Low Profile Quad Flat Package, 10 x 10 mm Body, 0.5 mm Pitch; PartNumber: STM32F405RGT6
U5 = CMP-04917-000010-1: IC REG LINEAR 3.3V 500MA SOT23-5; Manufacturer: Texas Instruments; Dropout Voltage: 150mV; Max Junction Temp: +125°C; Number Of Outputs: 1; Output Type: Fixed; Accuracy Percentage: 1%; Standoff Height: 0mm; Max Supply Voltage: 5.5V; Min Supply Voltage: 1.45V; RoHS: TRUE; ComponentLink2Description: Datasheet; Octopart: https://octopart.com/tlv75533pdbvr-texas+instruments-91272349; Ambient Temperature Range High: +70°C; Device Class L2: Power Management ICs; Lead Free: Yes; Temperature Range Low: -40°C; Output Current: 500mA; Temperature: -40°C to +125°C; Automotive: No; Manufacturer Part Number: TLV75533PDBVR; Digikey Description: IC REG LINEAR 3.3V 500MA SOT23-5; Height: 1.45mm; Temperature Range High: +125°C; ComponentLink2URL: http://www.ti.com/lit/ds/symlink/tlv755p.pdf; Device Class L3: Voltage Regulators - Linear; Device Class L1: Integrated Circuits (ICs); Output Voltage: 3.3V; Mouser Description: 500-mA low-IQ small-size low-dropout (LDO) regulator 5-SOT-23 -40 to 125; Package: DBV0005A; Category: IC
Y1 = CMP-27762-004085-1: CRYSTAL 8.0000MHZ 18PF SMD